# Altium project 211105 Precharge Controller R4b.PrjPcb (part 2 of 2)
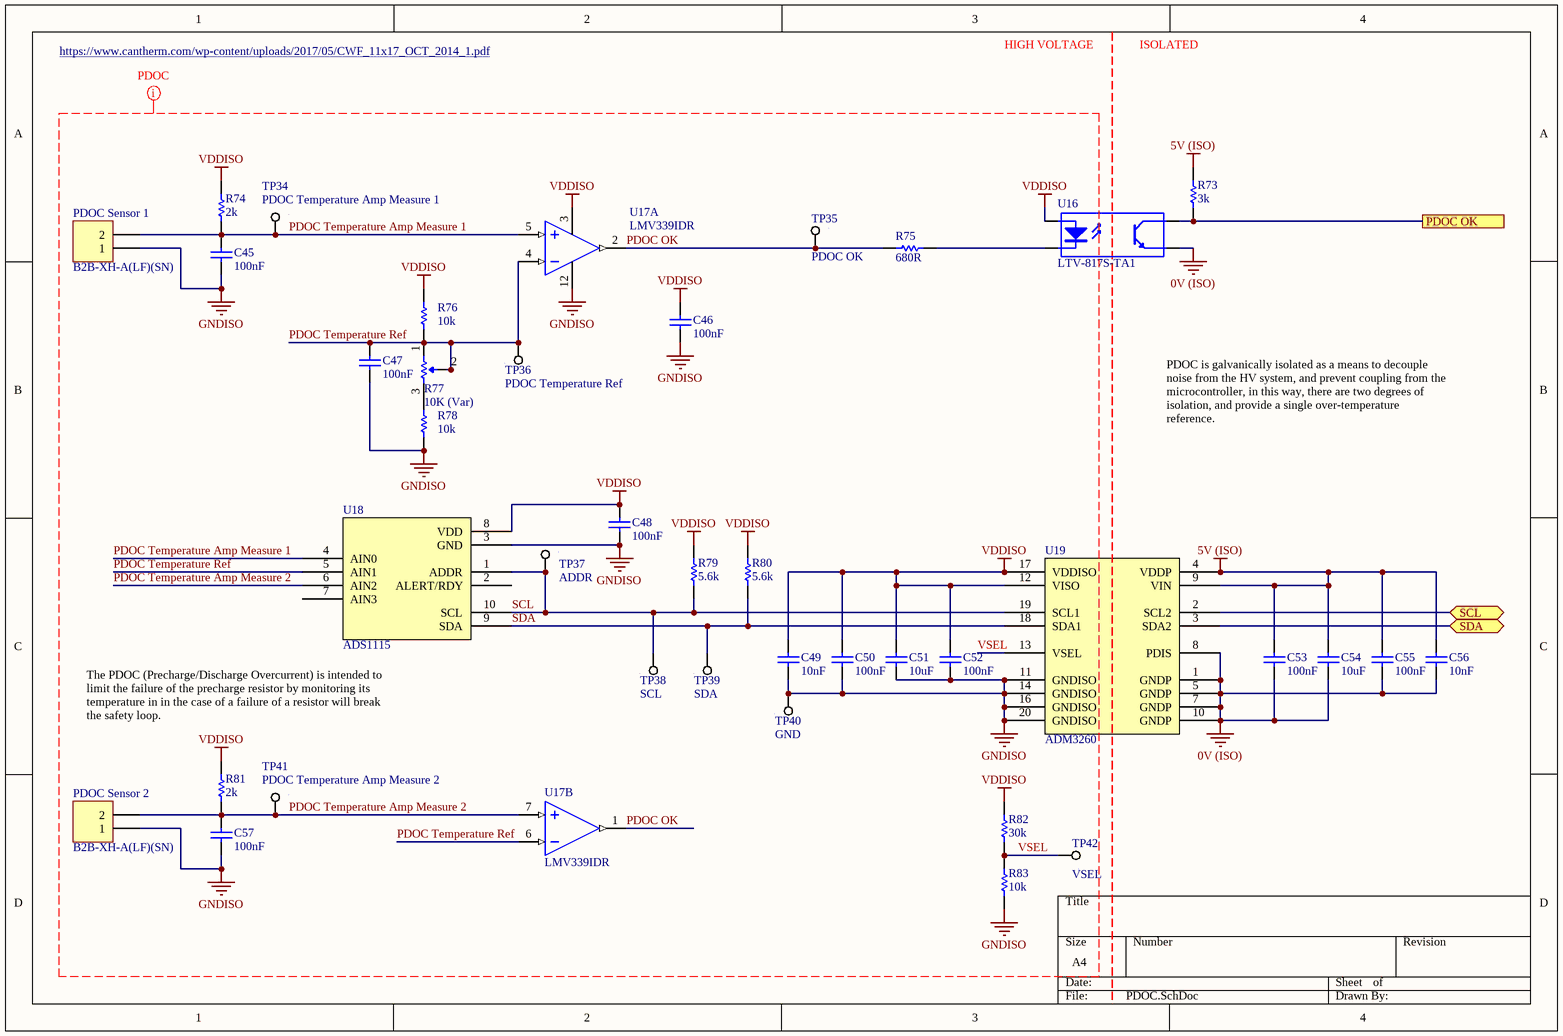
[diagram p7: PDOC.SchDoc]

## Nets that join several sheets
0V: Top Level (P1.2), Power Supply (8 pins), Precharge (5 pins), Safety Loops (R32.1 R36.2)
0V (ISO): Power Supply (10 pins), Precharge (9 pins), Microcontroller (35 pins), Safety Loops (6 pins), U_Battery_HV Sense (9 pins), U_MC_HV Sense (9 pins), PDOC (10 pins)
3.3V (ISO): Power Supply (5 pins), Microcontroller (16 pins)
5V: Power Supply (C15.2 D3.A TP5.1 U4.3), Precharge (5 pins)
5V (ISO): Power Supply (7 pins), Precharge (8 pins), Microcontroller (10 pins), Safety Loops (11 pins), U_Battery_HV Sense (6 pins), U_MC_HV Sense (6 pins), PDOC (7 pins)
12V/24V (Filtered): Top Level (P1.1), Power Supply (7 pins)
AIR Power: Top Level (PRIMARY_INTERFACE1.12 PRIMARY_INTERFACE1.13 PRIMARY_INTERFACE1.17), Precharge (7 pins)
GLV-: Top Level (PRIMARY_INTERFACE1.1 PRIMARY_INTERFACE1.11 PRIMARY_INTERFACE1.16 PRIMARY_INTERFACE1.20), Power Supply (5 pins), Precharge (6 pins), Safety Loops (R37.2)
HV Battery-: Top Level (HV_BATTERY-1.1 HV_BATTERY-1.2 HV_MC-1.1 HV_MC-1.2), U_Battery_HV Sense (14 pins), U_MC_HV Sense (13 pins), PDOC (20 pins)
VDDISO: U_Battery_HV Sense (12 pins), U_MC_HV Sense (13 pins), PDOC (17 pins)
AIR+: Top Level (PRIMARY_INTERFACE1.15), Precharge (D11.A D12.K Q3.D)
AIR+ (ISO): Precharge (R28.2 U9.3), Microcontroller (U15.31)
AIR+ Feedback (ISO): Precharge (R26.1 TP16.1), Microcontroller (U15.22)
AIR+ Feedback Out: Top Level (PRIMARY_INTERFACE1.14), Precharge (R24.1 U10.7)
AIR-: Top Level (PRIMARY_INTERFACE1.5 PRIMARY_INTERFACE1.19), Precharge (D7.A D8.K Q1.D)
AIR- (ISO): Precharge (R14.2 U9.2), Microcontroller (U15.29)
AIR- Feedback (ISO): Precharge (R12.1 TP13.1), Microcontroller (U15.21)
AIR- Feedback Out: Top Level (PRIMARY_INTERFACE1.18), Precharge (R10.1 U10.5)
AMS OK (ISO): Microcontroller (U15.26), Safety Loops (R39.1 R40.2 TP21.1)
GLV+: Top Level (PRIMARY_INTERFACE1.2), Power Supply (F1.1 TP6.1)
Green In: Top Level (PRIMARY_INTERFACE1.7), Safety Loops (IMD_Bypass1.2 K1.9)
Green Out: Top Level (PRIMARY_INTERFACE1.8), Safety Loops (K3.13 PDOC_Bypass1.1)
HV Battery+: Top Level (HV_BATTERY+1.1 HV_BATTERY+1.2), Precharge (R21.1), U_Battery_HV Sense (R43_U_Battery_HV_Sense.2)
HV MC+: Top Level (HV_MC+1.1 HV_MC+1.2), Precharge (R16.2), U_MC_HV Sense (R43_U_MC_HV_Sense.2)
IMD Data: Top Level (P1.5), Safety Loops (D15.A TP20.1 U10.3)
IMD Data (ISO): Microcontroller (U15.38), Safety Loops (R34.1)
IMD OK: Top Level (P1.3), Safety Loops (TP19.1 U10.1)
IMD OK (ISO): Microcontroller (U15.25), Safety Loops (Q4.G R31.1 R33.2 TP18.1)
NetR5_1: Precharge (R5.1 TP12.1), Microcontroller (U15.39)
PDOC OK (ISO): Microcontroller (U15.28), Safety Loops (R42.1 TP22.1), PDOC (R73.1 U16.4)
Precharge Relay (ISO): Precharge (R20.1 R22.2 TP15.1), Microcontroller (U15.30)
SCL: Microcontroller (R60.1 TP29.1 U15.42), U_Battery_HV Sense (U14_U_Battery_HV_Sense.2), U_MC_HV Sense (U14_U_MC_HV_Sense.2), PDOC (U19.2)
SDA: Microcontroller (R61.1 TP30.1 U15.43), U_Battery_HV Sense (U14_U_Battery_HV_Sense.3), U_MC_HV Sense (U14_U_MC_HV_Sense.3), PDOC (U19.3)